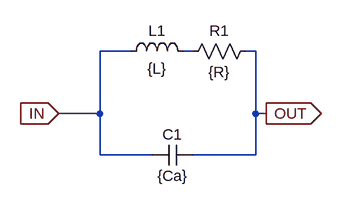
[diagram p0: schematic coil_resistor.asc]
coil_resistor.asc, the LTspice schematic file:
Version 4
SHEET 1 880 680
WIRE 160 80 112 80
WIRE 256 80 240 80
WIRE 352 80 336 80
WIRE 112 176 112 80
WIRE 112 176 48 176
WIRE 352 176 352 80
WIRE 368 176 352 176
WIRE 112 240 112 176
WIRE 192 240 112 240
WIRE 352 240 352 176
WIRE 352 240 256 240
FLAG 48 176 IN
IOPIN 48 176 In
FLAG 368 176 OUT
IOPIN 368 176 Out
SYMBOL ind 144 96 R270
WINDOW 0 32 56 VTop 2
WINDOW 3 5 56 VBottom 2
SYMATTR InstName L1
SYMATTR Value {L}
SYMBOL cap 192 256 R270
WINDOW 0 32 32 VTop 2
WINDOW 3 0 32 VBottom 2
SYMATTR InstName C1
SYMATTR Value {Ca}
SYMBOL res 352 64 R90
WINDOW 0 0 56 VBottom 2
WINDOW 3 32 56 VTop 2
SYMATTR InstName R1
SYMATTR Value {R}

The netlist it stands for:
* coil_resistor.asc
L1 IN N001 {L}
C1 IN OUT {Ca}
R1 OUT N001 {R}
.backanno
.end